# EAGLE design samd21_QFP_reference (EAGLE 9.2.2)
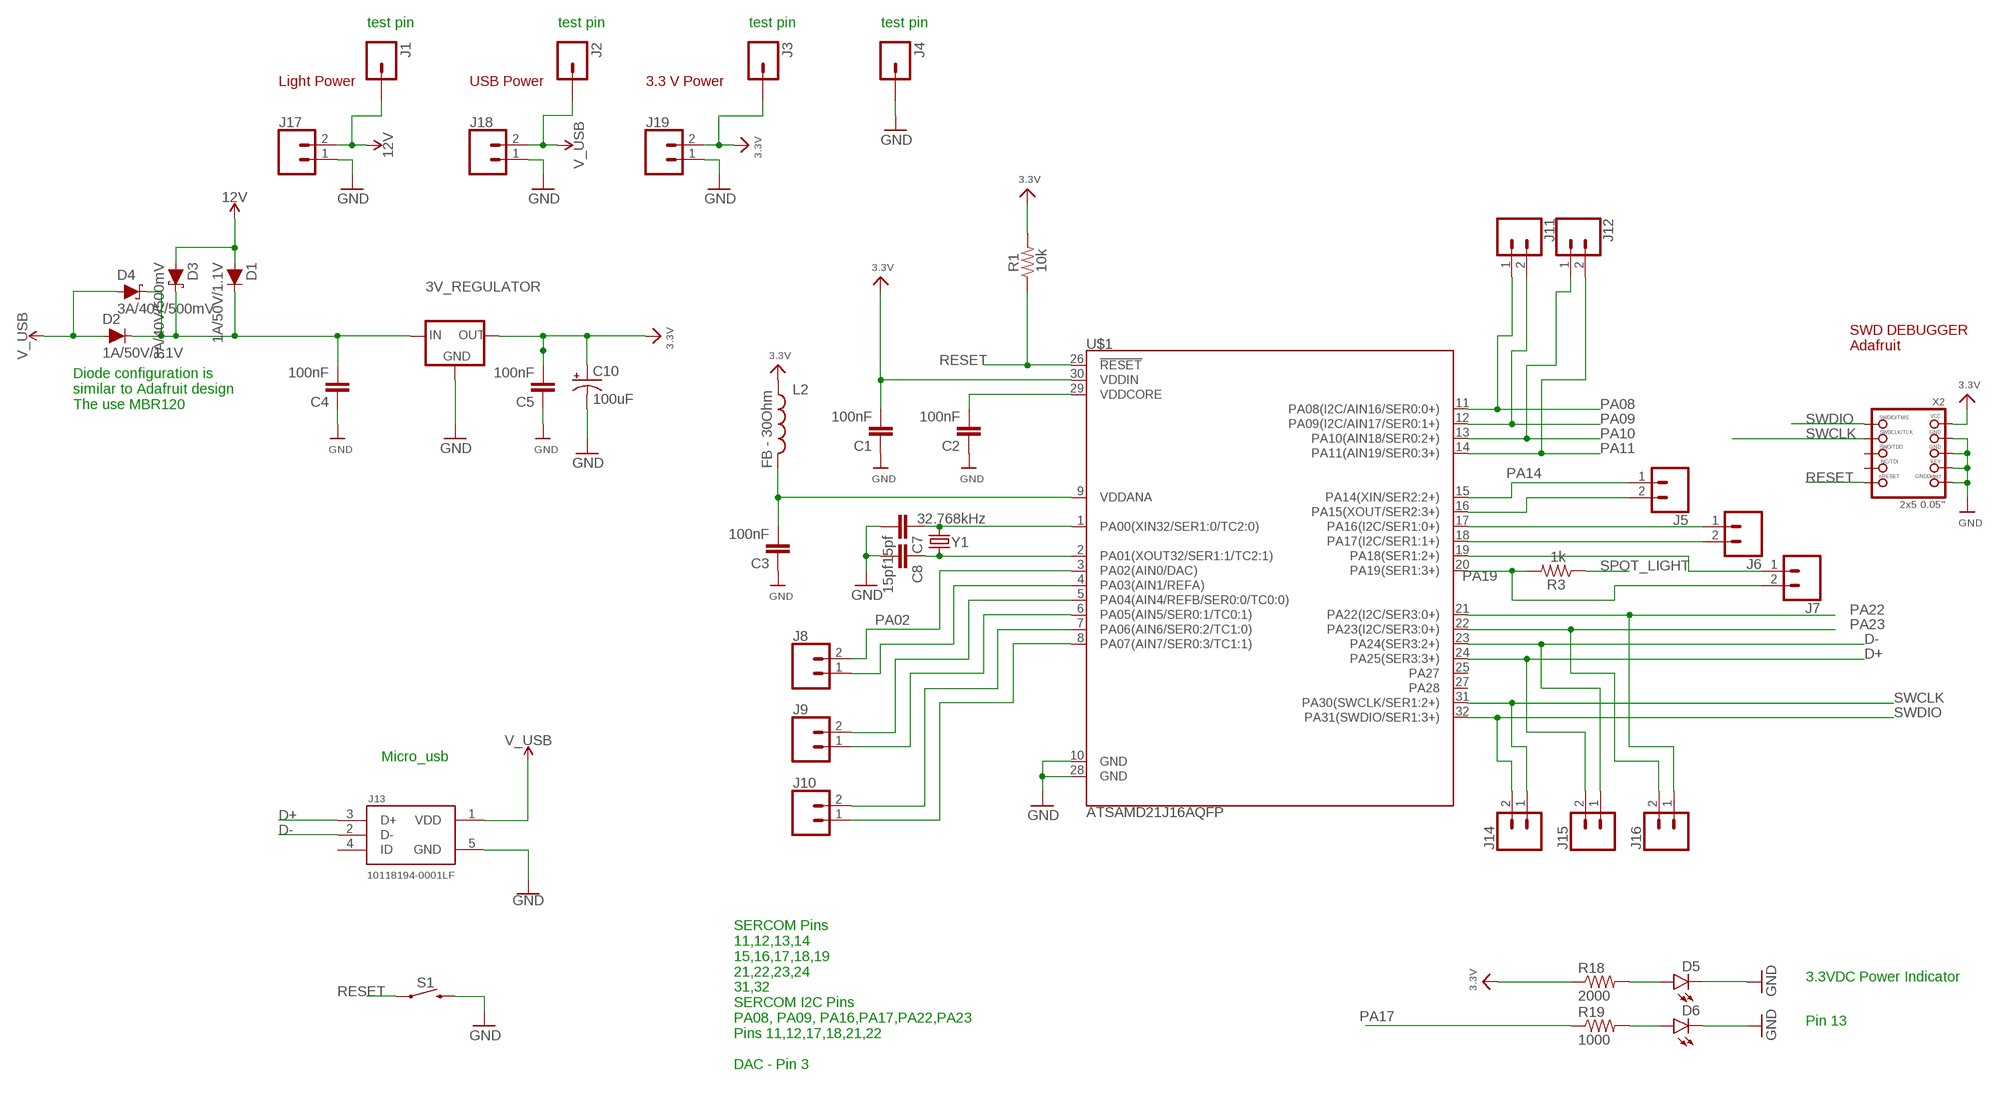
[diagram p0: schematic, sheet 1, part 1 of 2]
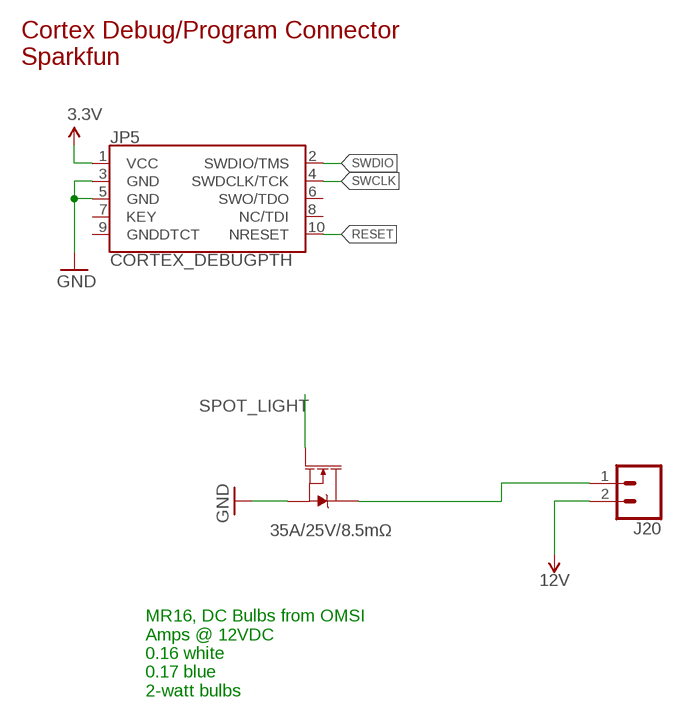
[diagram p1: schematic, sheet 1, part 2 of 2]

## Parts
3V_REGULATOR  LDL1117_5V_REG  [SOT223]
C1  100nF  10UF-0805-10V-10%  [0805]
C2  100nF  10UF-0805-10V-10%  [0805]
C3  100nF  10UF-0805-10V-10%  [0805]
C4  100nF  10UF-0805-10V-10%  [0805]
C5  100nF  10UF-0805-10V-10%  [0805]
C7  15pf  10UF-0805-10V-10%  [0805]
C8  15pf  10UF-0805-10V-10%  [0805]
C10  100uF  100UF-POLAR-RADIAL-2.5MM-25V-20%  [CPOL-RADIAL-2.5MM-6.5MM]
D1  1A/50V/1.1V  DIODE-PTH  [DIODE-1N4001]
D2  1A/50V/1.1V  DIODE-PTH  [DIODE-1N4001]
D3  3A/40V/500mV  DIODE-SCHOTTKY-B340A  [SMA-DIODE]
D4  3A/40V/500mV  DIODE-SCHOTTKY-B340A  [SMA-DIODE]
D5  LED1206  [LED-1206]
D6  LED1206  [LED-1206]
J1  M01PTH  [1X01]
J2  M01PTH  [1X01]
J3  M01PTH  [1X01]
J4  M01PTH  [1X01]
J5  CONN_025MM  [SCREWTERMINAL-5MM-2]
J6  CONN_025MM  [SCREWTERMINAL-5MM-2]
J7  CONN_025MM  [SCREWTERMINAL-5MM-2]
J8  CONN_025MM  [SCREWTERMINAL-5MM-2]
J9  CONN_025MM  [SCREWTERMINAL-5MM-2]
J10  CONN_025MM  [SCREWTERMINAL-5MM-2]
J11  CONN_025MM  [SCREWTERMINAL-5MM-2]
J12  CONN_025MM  [SCREWTERMINAL-5MM-2]
J13  10118194-0001LF  [FRAMATOME_10118194-0001LF]
J14  CONN_025MM  [SCREWTERMINAL-5MM-2]
J15  CONN_025MM  [SCREWTERMINAL-5MM-2]
J16  CONN_025MM  [SCREWTERMINAL-5MM-2]
J17  CONN_025MM  [SCREWTERMINAL-5MM-2]
J18  CONN_025MM  [SCREWTERMINAL-5MM-2]
J19  CONN_025MM  [SCREWTERMINAL-5MM-2]
J20  CONN_025MM  [SCREWTERMINAL-5MM-2]
JP5  CORTEX_DEBUGPTH  [2X5-PTH-1.27MM]
L2  FB - 30Ohm  INDUCTOR0805  [0805@1]
Q1  35A/25V/8.5mΩ  MOSFET-NCH-FDD8780  [DPAK]
R1  10k  RESISTOR0805  [0805]
R3  1k  RESISTOR0805  [0805]
R18  2000  RESISTOR0805-RES  [0805]
R19  1000  RESISTOR0805-RES  [0805]
S1  MOMENTARY-SWITCH-SPST-PTH-6.0MM-KIT  [TACTILE_SWITCH_PTH_6.0MM_KIT]
U$1  ATSAMD21J16AQFP  [TQFP32-08]
X2  2x5 0.05"  JTAG-CORTEXBOXPOSTS  [2X05_1.27MM_BOX_POSTS]
Y1  32.768kHz  CRYSTAL3.2X1.5MM  [CRYSTAL-SMD-3.2X1.5MM]

## Nets
3.3V [power]: 3V_REGULATOR.2(OUT) 3V_REGULATOR.4(OUT) C1.2 C5.2 C10.1(+) J3.1 J19.2 JP5.1(VCC) L2.1 R1.2 R18.1 U$1.30(VDDIN) X2.1(VCC)
12V: D1.A D3.A J1.1 J17.2 J20.2
D+: J13.3(D+) J15.2 U$1.24(PA25(SER3:3+))
D-: J13.2(D-) J15.1 U$1.23(PA24(SER3:2+))
GND: 3V_REGULATOR.1(GND) C1.1 C2.1 C3.1 C4.1 C5.1 C7.2 C8.2 C10.2(-) D5.C D6.C J4.1 J13.5(GND) J17.1 J18.1 J19.1 JP5.3(GND) JP5.5(GND) Q1.3(S) S1.3 U$1.10(GND) U$1.28(GND) X2.3(GND) X2.5(GND) X2.7(KEY) X2.9(GNDDETECT)
N$1: C3.2 L2.2 U$1.9(VDDANA)
N$2: C7.1 U$1.1(PA00(XIN32/SER1:0/TC2:0)) Y1.P$2
N$3: C2.2 U$1.29(VDDCORE)
N$4: C8.1 U$1.2(PA01(XOUT32/SER1:1/TC2:1)) Y1.P$1
N$5: 3V_REGULATOR.3(IN) C4.2 D1.C D2.C D3.C D4.C
N$21: J20.1 Q1.4(D)
N$30: D5.A R18.2
N$31: D6.A R19.2
PA02: J8.2 U$1.3(PA02(AIN0/DAC))
PA03: J8.1 U$1.4(PA03(AIN1/REFA))
PA04: J9.2 U$1.5(PA04(AIN4/REFB/SER0:0/TC0:0))
PA05: J9.1 U$1.6(PA05(AIN5/SER0:1/TC0:1))
PA06: J10.2 U$1.7(PA06(AIN6/SER0:2/TC1:0))
PA07: J10.1 U$1.8(PA07(AIN7/SER0:3/TC1:1))
PA08: J11.1 U$1.11(PA08(I2C/AIN16/SER0:0+))
PA09: J11.2 U$1.12(PA09(I2C/AIN17/SER0:1+))
PA10: J12.1 U$1.13(PA10(AIN18/SER0:2+))
PA11: J12.2 U$1.14(PA11(AIN19/SER0:3+))
PA14: J5.1 U$1.15(PA14(XIN/SER2:2+))
PA15: J5.2 U$1.16(PA15(XOUT/SER2:3+))
PA16: J6.1 U$1.17(PA16(I2C/SER1:0+))
PA17: J6.2 R19.1 U$1.18(PA17(I2C/SER1:1+))
PA18: J7.1 U$1.19(PA18(SER1:2+))
PA19: J7.2 R3.2 U$1.20(PA19(SER1:3+))
PA22: J16.1 U$1.21(PA22(I2C/SER3:0+))
PA23: J16.2 U$1.22(PA23(I2C/SER3:0+))
RESET: JP5.10(NRESET) R1.1 S1.1 U$1.26(!RESET!) X2.10(NRESET)
SPOT_LIGHT: Q1.1(G) R3.1
SWCLK: J14.1 JP5.4(SWDCLK/TCK) U$1.31(PA30(SWCLK/SER1:2+)) X2.4(SWDCLK)
SWDIO: J14.2 JP5.2(SWDIO/TMS) U$1.32(PA31(SWDIO/SER1:3+)) X2.2(SWDIO)
V_USB: D2.A D4.A J2.1 J13.1(VDD) J18.2
Unconnected: J13.4(ID) JP5.6(SWO/TDO) JP5.7(KEY) JP5.8(NC/TDI) JP5.9(GNDDTCT) U$1.25(PA27) U$1.27(PA28) X2.6(SWO) X2.8(TDI)

## Notes on the sheet
- test pin | test pin | test pin | test pin
- Light Power | USB Power | 3.3 V Power
- Cortex Debug/Program Connector
  Sparkfun
- SWD DEBUGGER
  Adafruit
- Diode configuration is
  similar to Adafruit design
  The use MBR120
- Micro_usb
- MR16, DC Bulbs from OMSI
  Amps @ 12VDC
  0.16 white
  0.17 blue
  2-watt bulbs
- 3.3VDC Power Indicator
- Pin 13
- SERCOM Pins
  11,12,13,14
  15,16,17,18,19
  21,22,23,24
  31,32
  SERCOM I2C Pins
  PA08, PA09, PA16,PA17,PA22,PA23
  Pins 11,12,17,18,21,22
  
  DAC - Pin 3

## Library data of the parts
3V_REGULATOR = th_libraries_2:LDL1117_5V_REG: STMicroelectronics LDL1117S50R https://www.mouser.com/datasheet/2/389/ldl1117-1156241.pdf Mouser#: 511-LDL1117S50R bought 100 for $18 on ~2/3/18 5V, 1.2amp
C1-C5 C7 C8 = SparkFun-Capacitors:10UF: 10.0µF ceramic capacitors A capacitor is a passive two-terminal electrical component used to store electrical energy temporarily in an electric field.; PROD_ID: CAP-11330; VALUE: 10uF
C10 = SparkFun-Capacitors:100UF-POLAR: 100µF polarized capacitors A capacitor is a passive two-terminal electrical component used to store electrical energy temporarily in an electric field.; PROD_ID: CAP-08439
D1 D2 = SparkFun-DiscreteSemi:DIODE: Diode These are standard reverse protection diodes and small signal diodes. SparkFun Products: SparkFun SparkPunk Sound Kit <https://www.sparkfun.com/products/11177> SparkFun ESP8266 Thing <https://www.sparkfun.com/products/13231>; PROD_ID: DIO-09176
D3 D4 = SparkFun-DiscreteSemi:DIODE-SCHOTTKY: Schottky diode A Schottky diode is a semiconductor diode which has a low forward voltage drop and a very fast switching action.; PROD_ID: DIO-09886
D5 D6 = SparkFun-LED:LED: LEDs Standard schematic elements and footprints for 5mm, 3mm, 1206, and 0603 sized LEDs. 5mm - Spark Fun Electronics SKU : COM-00529 (and others)
J1-J4 = SparkFun-Connectors:M01: Header 1 Standard 1-pin 0.1" header. Use with straight break away headers (SKU : PRT-00116), right angle break away headers (PRT-00553), swiss pins (PRT-00743), machine pins (PRT-00117), and female headers (PRT-00115). SMTSO-256-ET is a "flush mount" nut for a 4-40 screw. The older package used to be too tight, and did not allow it to sit properly thru the drill hit. The latest (0.165DIA) fits nice and snug.
J5-J12 J14-J20 = SparkFun-Connectors:CONN_02: Multi connection point. Often used as Generic Header-pin footprint for 0.1 inch spaced/style header connections On any of the 0.1 inch spaced packages, you can populate with these: Break Away Headers - Straight <https://www.sparkfun.com/products/116> (PRT-00116) Break Away Male Headers - Right Angle <https://www.sparkfun.com/products/553> (PRT-00553) Female Headers <https://www.sparkfun.com/products/115> (PRT-00115) Break Away Headers - Machine Pin <https://www.sparkfun.com/products/117> (PRT-00117) Break Away Female Headers - Swiss Machine Pin <https://www.sparkfun.com/products/743> (PRT-00743) For SCREWTERMINALS and SPRING TERMINALS visit here: Screw Terimnals on SparkFun.com <https://www.sparkfun.com/search/results?term=Screw+Terminals> (5mm/3.5mm/2.54mm spacing) This device is also useful as a general connection point to wire up your design to another part of your project. Our various solder wires solder well into these plated through hole pads. Hook-Up Wire - Assortment (Stranded, 22 AWG) <https://www.sparkfun.com/products/11375> (PRT-11375) Hook-Up Wire - Assortment (Solid Core, 22 AWG) <https://www.sparkfun.com/products/11367> (PRT-11367) View the entire wire category on our website here <https://www.sparkfun.com/categories/141> Special notes: Molex polarized connector foot print use with: PRT-08233 with associated crimp pins and housings. 2.54_SCREWTERM for use with PRT-10571. 3.5mm Screw Terminal footprints for PRT-08084 5mm Screw Terminal footprints for use with PRT-08432; SF_SKU: PRT-08432
J13 = 10118194-0001LF:10118194-0001LF: Conn Micro USB Type B RCP 5 POS 0.65mm Solder RA SMD 5 Terminal 1 Port T/R; AVAILABILITY: Unavailable; DESCRIPTION: Micro Usb, 2.0 Type b, Rcpt, Smt; MF: Amphenol ICC; MP: 10118194-0001LF; PACKAGE: None; PRICE: None
JP5 = samd21-temp:CORTEX_DEBUG: Cortex Debug Connector Datasheet <http://infocenter.arm.com/help/topic/com.arm.doc.faqs/attached/13634/cortex_debug_connectors.pdf>
L2 = SparkFun-Passives:INDUCTOR: Inductors Basic Inductor/Choke - 0603 and 1206. Footprints are not proven and vary greatly between part numbers. INDUCTOR POWER 3.3UH 4.0A SMD 0.197" L x 0.197" W x 0.177" H (5.00mm x 5.00mm x 4.50mm); PROD_ID: RES-07859
Q1 = th_libraries_2:MOSFET-NCH: N-channel MOSFETs Voltage controlled devices that allow control of high current outputs. SparkFun Products: SparkFun OpenScale <https://www.sparkfun.com/products/13261> SparkFun Digital Sandbox <https://www.sparkfun.com/products/12651> SparkFun Monster Moto Shield <https://www.sparkfun.com/products/10182> SparkFun MOSFET Power Controller <https://www.sparkfun.com/products/11214>; PROD_ID: TRANS-09984
R1 R3 = SparkFun-Resistors:RESISTOR: Generic Resistor Package
R18 R19 = SparkFun-Passives:RESISTOR: Resistor Basic schematic elements and footprints for 0603, 1206, and PTH resistors.
S1 = SparkFun-Switches:MOMENTARY-SWITCH-SPST: Momentary Switch (Pushbutton) - SPST Normally-open (NO) SPST momentary switches (buttons, pushbuttons). Variants PTH-12MM - 12mm square, through-hole Momentary Pushbutton Switch - 12mm Square <https://www.sparkfun.com/products/9190> (COM-09190) PTH-6.0MM, PTH-6.0MM-KIT - 6.0mm square, through-hole Mini Pushbutton Switch <https://www.sparkfun.com/products/97> (COM-00097) KIT package intended for soldering kit's - only one side of pads' copper is exposed. PTH-RIGHT-ANGLE-KIT - Right-angle, through-hole Right Angle Tactile Button <https://www.sparkfun.com/products/10791> - Used on SparkFun BigTime Watch Kit <https://www.sparkfun.com/products/11734> SMD-12MM - 12mm square, surface-mount Tactile Button - SMD (12mm) <https://www.sparkfun.com/products/12993> (COM-12993) Used on SparkFun PicoBoard <https://www.sparkfun.com/products/11888> SMD-4.5MM - 4.5mm Square Trackball Switch Used on SparkFun Blackberry Trackballer Breakout <https://www.sparkfun.com/products/13169> SMD-4.6MMX2.8MM - 4.60mm x 2.80mm, surface mount Used on SparkFun SAMD21 Mini Breakout <https://www.sparkfun.com/products/13664> SMD-5.2MM, SMD-5.2-REDUNDANT - 5.2mm square, surface-mount Mini Pushbutton Switch - SMD <https://www.sparkfun.com/products/8720> (COM-08720) Used on Arduino Pro Mini <https://www.sparkfun.com/products/11114> REDUNDANT package connects both switch circuits together SMD-6.0X3.5MM - 6.0 x 3.5mm, surface mount Momentary Reset Switch SMD <https://www.sparkfun.com/products/8229> (COM-08229) SMD-6.2MM-TALL - 6.2mm square, surface mount Tactile Button - SMD (6mm) <https://www.sparkfun.com/products/12992> Used on SparkFun Digital Sandbox <https://www.sparkfun.com/products/12651> SMD-RIGHT-ANGLE - Right-angle, surface mount Used on SparkFun Block for Intel® Edison - Arduino <https://www.sparkfun.com/products/13036>; PROD_ID: SWCH-08441; SF_SKU: COM-00097
U$1 = th_libraries_2:ATSAMD21J16A: ATSAMD21E - 32 pin packages ATSAMD21E15 is 32kb flash ATSAMD21E16 is 64kb flash ATSAMD21E17 is 128kb flash ATSAMD21E18 is 256kb flash
X2 = microbuilder:JTAG-CORTEX: Serial Wire (SW-DP) Connector Standard 0.05" 10-pin connector is for use with the Cortex M and Cortex A SWD (serial wire debugger) interface (SW-DP) Connectors 2x05_1.27MM_SMT - Inexpensive surface-mount header with bare pins, compatible with standard 10-pin SWD cables (4UCON: 16846) 2x05_1.27MM_BOX_NOPOSTS - Polarised surface-mount box (4UCON with caps: 19735, without caps: 15117 2x05_1.27MM_BOX_POSTS - Polarised surface-mount box with mounting holes (4UCON: 20317) Pinout: http://infocenter.arm.com/help/topic/com.arm.doc.faqs/attached/13634/cortex_debug_connectors.pdf http://www.keil.com/peripherals/coresight/connectors.asp
Y1 = samd21-temp:CRYSTAL: Various standard crystals. Proven footprints.; PROD_ID: XTAL-13062

## Net classes
1 power: width 0.254 mm

## Board
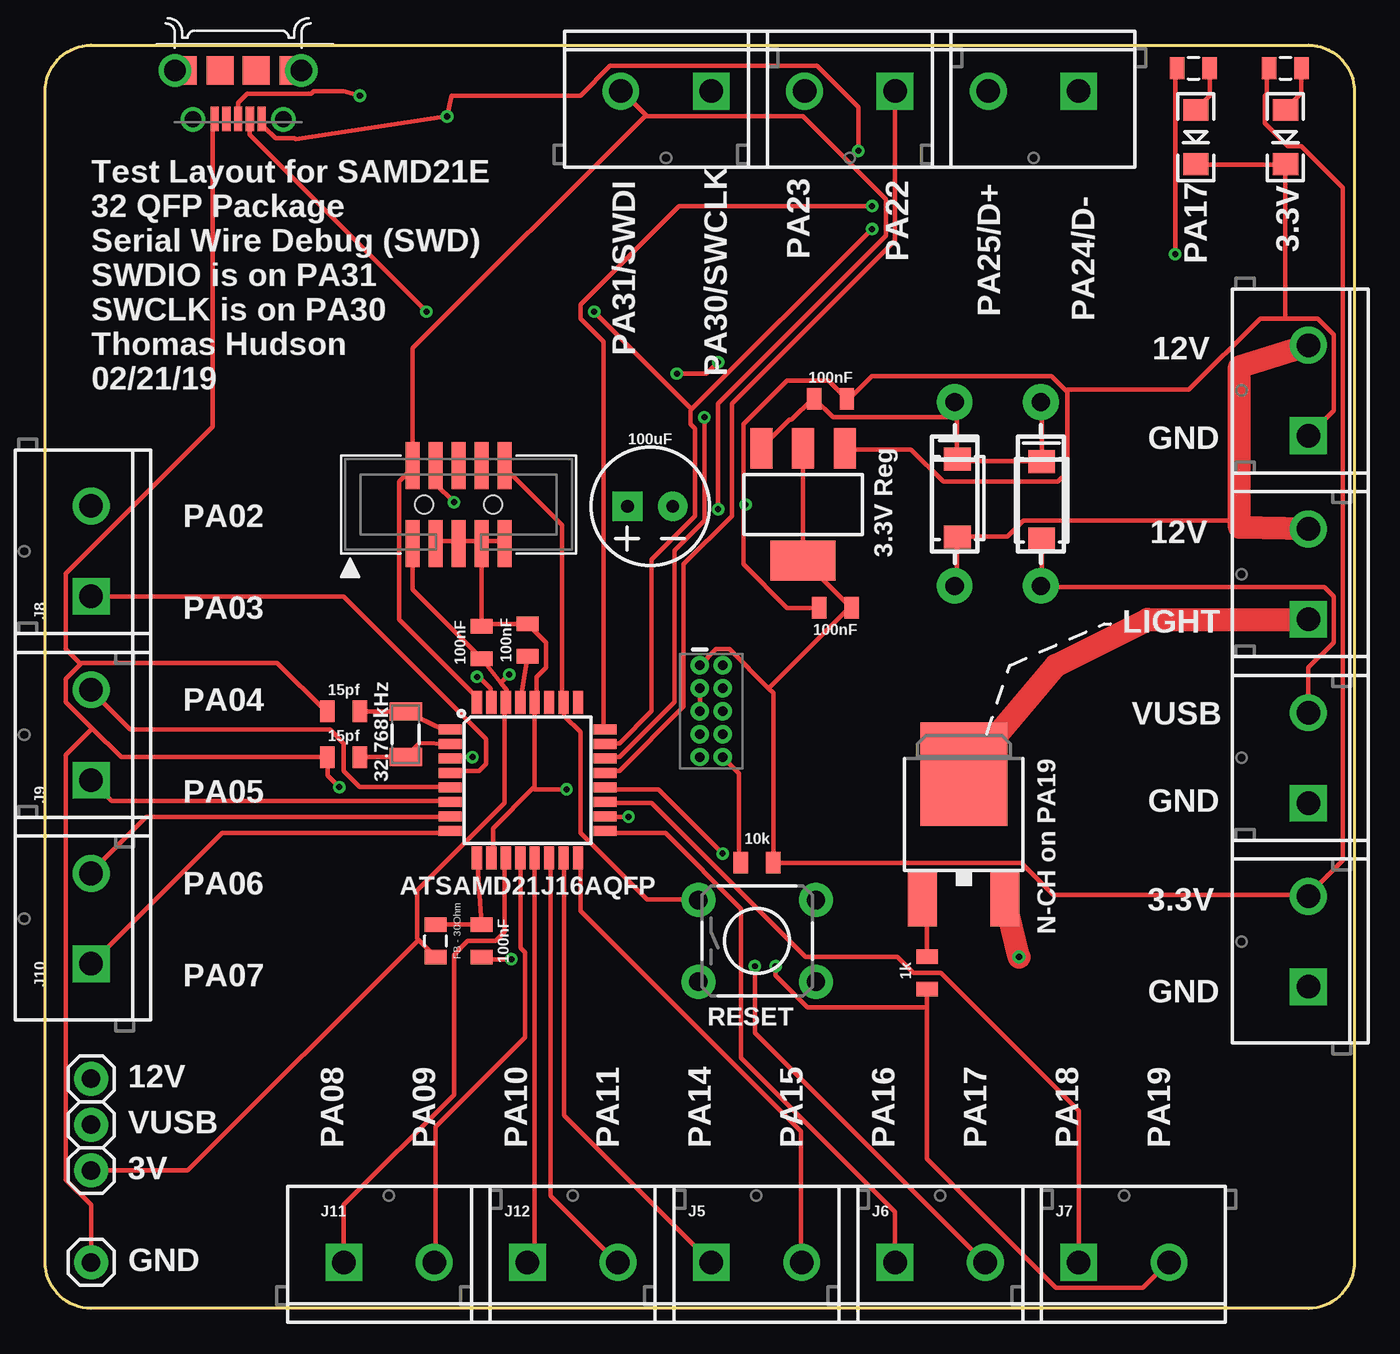
[diagram p2: board, top side]
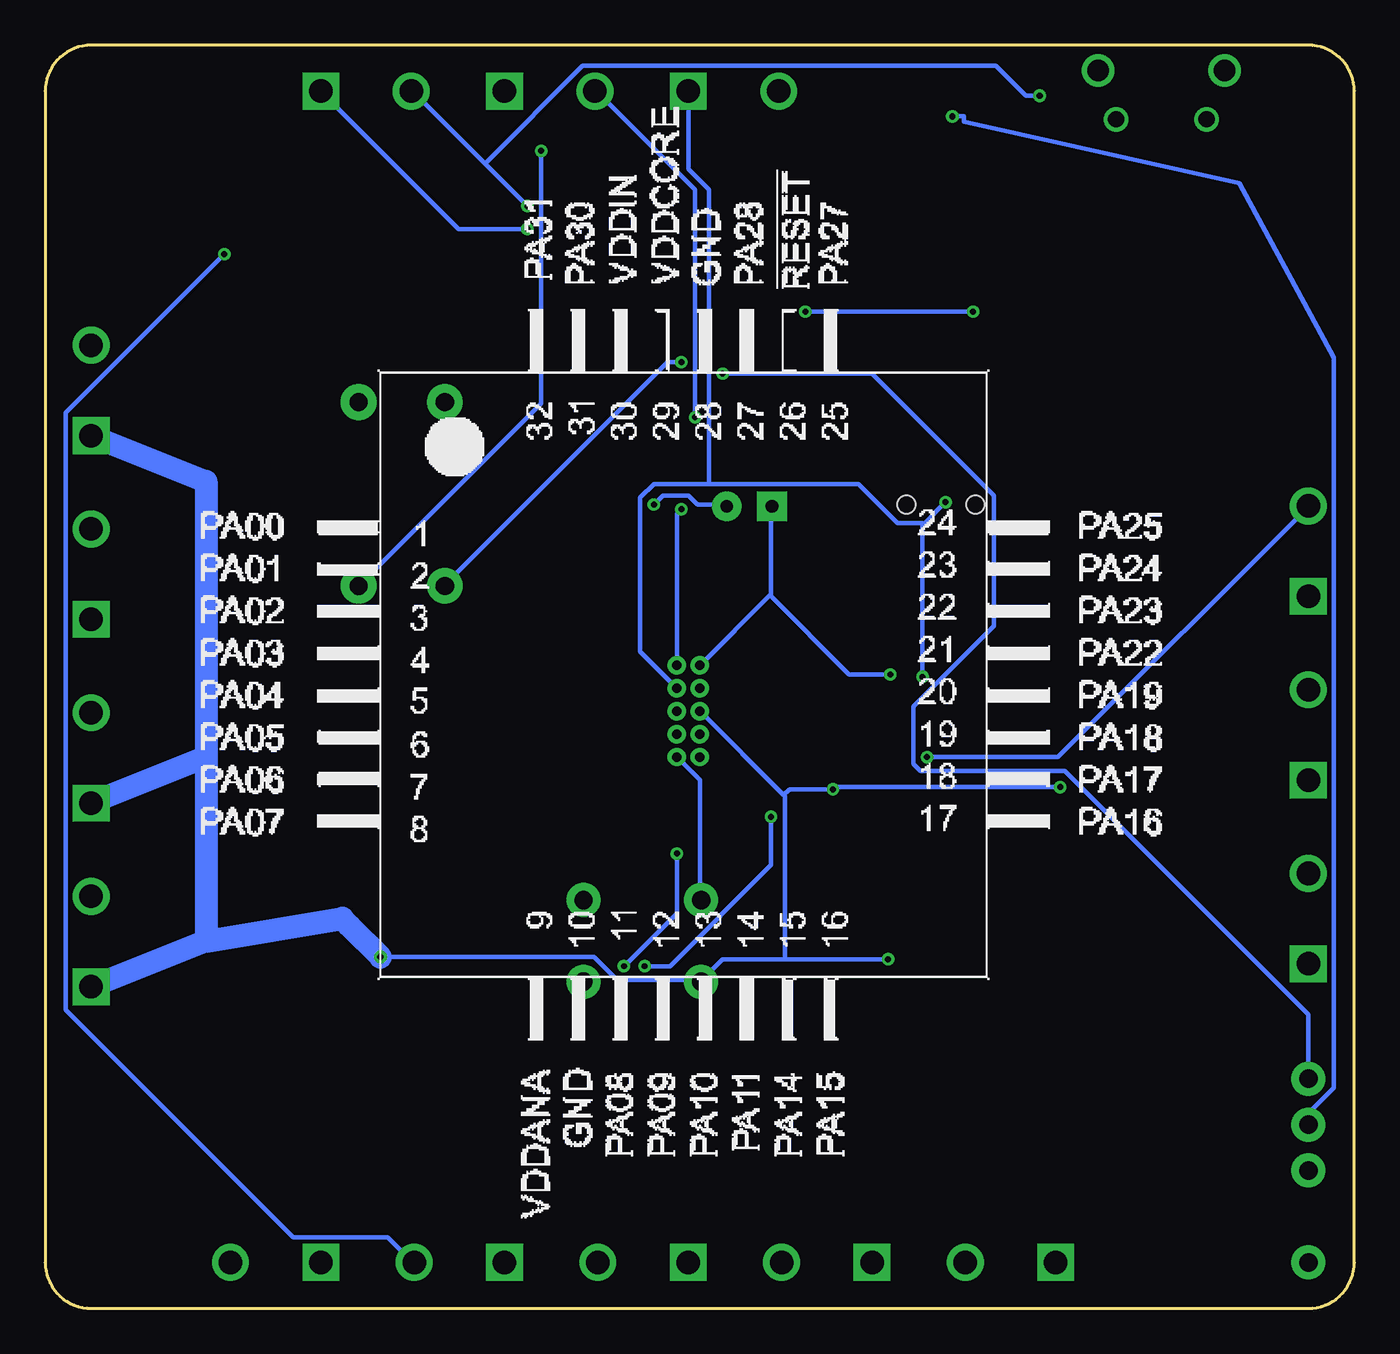
[diagram p3: board, bottom side, seen from below]

Size 72.39 x 69.85 mm. Coordinates in mm from the lower left corner, seen from the top.
Outline: 69.85,0 2.54,0 arc-90 0,2.54 0,67.31 arc-90 2.54,69.85 69.85,69.85 arc-90 72.39,67.31 72.39,2.54 arc-90 69.85,0
Copper layers (1*16): Top 0.0356mm / dielectric 1.5011mm / Bottom 0.0356mm
Design rules "LaenPCBOrder *": minimum track width 10mil, minimum drill 13mil, track to track 10mil, track to pad 10mil, pad to pad 10mil, via to via 10mil, smd to smd 10mil, copper to edge 15mil, drill to drill 8mil, minimum pad ring 7mil, minimum via ring 7mil, stop-mask expansion 3mil, vias tented up to drill 25mil, thermal gap 10mil

### Footprints (pad centres in the part's own frame; a part is rotated, then mirrored left to right if it is on the bottom)
SOT223 = smd 1.219 x 2.235: 1 -2.311,-3.099; 2 0,-3.099; 3 2.311,-3.099 | smd 3.6 x 2.2: 4 0,3.099
0805 = smd 0.8 x 1.2: 1 -0.9,0; 2 0.9,0
CPOL-RADIAL-2.5MM-6.5MM = drill 0.7 pad 1.651 square: 1 1.25,0 | drill 0.7 pad 1.651: 2 -1.25,0
DIODE-1N4001 = drill 1 pad 1.981: A -5.08,0; C 5.08,0
SMA-DIODE = smd 1.27 x 1.47: A -2.15,0; C 2.15,0
LED-1206 = smd 1.2 x 1.4: A -1.5,0; C 1.5,0
1X01 = drill 1.016 pad 1.88: 1 0,0
SCREWTERMINAL-5MM-2 = drill 1.3 pad 2.032 square: 1 0,0 | drill 1.3 pad 2.032: 2 5,0
FRAMATOME_10118194-0001LF = smd 0.45 x 1.35: 1 -1.3,2.675; 2 -0.65,2.675; 3 0,2.675; 4 0.65,2.675; 5 1.3,2.675 | drill 0.9: P$6 -2.5,2.7; P$7 2.5,2.7 | drill 1.2: P$8 -3.5,0; P$9 3.5,0 | smd 1.5 x 1.55: P$10 -1,0; P$11 1,0; P$12 -3.05,0; P$13 3.05,0
2X5-PTH-1.27MM = drill 0.508 pad 1: 1 -2.54,-0.635; 2 -2.54,0.635; 3 -1.27,-0.635; 4 -1.27,0.635; 5 0,-0.635; 6 0,0.635; 7 1.27,-0.635; 8 1.27,0.635; 9 2.54,-0.635; 10 2.54,0.635
0805@1 = smd 0.8 x 1.2: 1 -0.9,0; 2 0.9,0
DPAK = smd 1.6 x 3: 1 -2.28,-5.31; 3 2.28,-5.31 | smd 4.826 x 5.715: 4 0,1.588
TACTILE_SWITCH_PTH_6.0MM_KIT = drill 1.016 pad 1.88: 1 -3.251,2.261; 2 3.251,2.261; 3 -3.251,-2.261; 4 3.251,-2.261
TQFP32-08 = smd 1.27 x 0.559: 1 -4.293,2.8; 2 -4.293,2; 3 -4.293,1.2; 4 -4.293,0.4; 5 -4.293,-0.4; 6 -4.293,-1.2; 7 -4.293,-2; 8 -4.293,-2.8; 17 4.293,-2.8; 18 4.293,-2; 19 4.293,-1.2; 20 4.293,-0.4; 21 4.293,0.4; 22 4.293,1.2; 23 4.293,2; 24 4.293,2.8 | smd 0.559 x 1.27: 9 -2.8,-4.293; 10 -2,-4.293; 11 -1.2,-4.293; 12 -0.4,-4.293; 13 0.4,-4.293; 14 1.2,-4.293; 15 2,-4.293; 16 2.8,-4.293; 25 2.8,4.293; 26 2,4.293; 27 1.2,4.293; 28 0.4,4.293; 29 -0.4,4.293; 30 -1.2,4.293; 31 -2,4.293; 32 -2.8,4.293
2X05_1.27MM_BOX_POSTS = smd 0.76 x 2.6: 1 -2.54,-2.15; 2 -2.54,2.15; 3 -1.27,-2.15; 4 -1.27,2.15; 5 0,-2.15; 6 0,2.15; 7 1.27,-2.15; 8 1.27,2.15; 9 2.54,-2.15; 10 2.54,2.15 | hole 1: -1.905,0; 1.905,0
CRYSTAL-SMD-3.2X1.5MM = smd 1 x 1.8: P$1 -1.25,0; P$2 1.25,0

### Placement (x,y rotation side)
3V_REGULATOR  41.91,44.45 180 top
C1  24.13,36.83 270 top
C2  26.67,36.96 270 top
C3  24.13,20.32 90 top
C4  43.43,50.29 180 top
C5  43.69,38.73 0 top
C7  16.51,33.02 180 top
C8  16.51,30.48 180 top
C10  33.45,44.35 180 top
D1  50.29,45.03 90 top
D2  55.07,45.03 90 top
D3  50.44,44.81 90 top
D4  55.09,44.68 90 top
D5  68.58,64.77 270 top
D6  63.63,64.77 270 top
J1  2.54,12.7 0 top
J2  2.54,10.16 0 top
J3  2.54,7.62 0 top
J4  2.54,2.54 0 top
J5  36.83,2.54 0 top
J6  46.99,2.54 0 top
J7  57.15,2.54 0 top
J8  2.54,39.37 90 top
J9  2.54,29.21 90 top
J10  2.54,19.05 90 top
J11  16.51,2.54 0 top
J12  26.67,2.54 0 top
J13  10.67,68.45 180 top
J14  36.83,67.31 180 top
J15  57.15,67.31 180 top
J16  46.99,67.31 180 top
J17  69.85,48.26 90 top
J18  69.85,27.94 90 top
J19  69.85,17.78 90 top
J20  69.85,38.1 90 top
JP5  36.83,33.02 270 top
L2  21.59,20.32 90 top
Q1  50.8,27.94 0 top
R1  39.37,24.64 0 top
R3  48.77,18.54 270 top
R18  68.58,68.58 0 top
R19  63.5,68.58 0 top
S1  39.37,20.32 0 top
U$1  26.67,29.21 0 top
X2  22.86,44.45 0 top
Y1  19.94,31.75 90 top

### Tracks (layer width: path | path; a pad name or v marks a point on that pad's centre or on a via)
3.3V  (via drill 0.33)
  Top 0.254: 25.18,34.6 C1.2 20.32,39.75 X2.1 | 25.18,34.6 25.53,34.16 U$1.30 25.4,33.4 25.4,27.94 20.57,23.11 20.57,20.45 20.64,20.38 | 20.64,20.38 21.59,19.43 L2.1 | 41.91,41.4 44.58,38.73 C5.2 44.45,38.73 40,34.29 | 41.91,41.4 3V_REGULATOR.2 | 41.91,41.4 3V_REGULATOR.4 | 40,34.29 37.85,36.45 37.08,36.45 JP5.1 | 40,34.29 40.26,34.04 40.26,24.64 R1.2 53.97,24.64 55.75,22.86 69.85,22.86 | v25.65,35.05 25.27,34.67 25.18,34.6 | 69.85,22.86 71.75,24.76 71.75,61.98 69.47,64.26 68.71,64.26 67.44,65.53 67.44,67.06 67.56,67.18 67.56,68.58 R18.1 | 69.85,22.86 J19.2 | J3.1 7.87,7.62 20.64,20.38
  Bottom 0.254: JP5.1 32.32,39.43 | 32.32,39.43 32.26,39.5 32.26,44.32 C10.1 | v25.65,35.05 27.94,35.05 32.32,39.43
12V  (via drill 0.33)
  Top 0.254: D1.A 50.29,40.01 50.42,40.13 50.42,42.55 D3.A 50.55,42.67 53.21,42.67 54.1,43.56 66.04,43.56 | v34.92,51.69 36.58,51.69 v37.21,52.32
  Top 1.27: J20.2 66.04,43.18 66.04,43.56 66.04,52.07 J17.2
  Bottom 0.254: J1.1 2.54,16.26 16,29.72 24,29.72 24.38,30.1 24.38,33.27 19.94,37.72 19.94,44.96 26.67,51.69 v34.92,51.69 | v37.21,52.32 37.97,52.32 50.29,40.01 D1.A
D+  (via drill 0.33, 0.35)
  Top 0.254: v45.72,60.96 35.05,60.96 29.59,55.5 29.59,54.74 30.86,53.47 30.86,32.13 U$1.24 | J13.3 10.67,66.67 11.16,67.17 14.7,67.17 14.84,67.31 16.51,67.31 v17.4,67.06
  Bottom 0.254: 48.07,63.31 52.07,67.31 J15.2 | 48.07,63.31 v45.72,60.96 | v17.4,67.06 18.16,67.06 19.81,68.71 42.67,68.71 48.07,63.31
D-  (via drill 0.33)
  Top 0.254: v45.72,59.69 35.75,49.72 | 35.75,49.72 35.69,49.66 35.69,48.9 35.94,48.64 35.94,43.82 33.53,41.4 33.53,33.02 31.75,31.24 30.99,31.24 U$1.23 | v21.08,55.12 11.3,64.9 11.3,65.66 J13.2 | 35.75,49.72 v30.35,55.12
  Bottom 0.254: v45.72,59.69 49.53,59.69 J15.1 | v30.35,55.12 v21.08,55.12
GND  (via drill 0.33, 0.35)
  Top 0.254: 2.6,32.07 1.14,33.53 1.14,34.8 1.97,35.62 | 2.6,32.07 4.19,30.48 C8.2 15.62,30.48 15.62,29.46 v16.26,28.83 | 1.97,35.62 2.03,35.69 12.83,35.69 15.49,33.02 C7.2 | 1.97,35.62 1.14,36.45 1.14,40.64 9.27,48.77 9.27,65.66 J13.5 | 26.99,28.77 27.05,28.83 27.05,33.4 U$1.28 27.18,33.53 27.18,34.92 27.69,35.43 27.69,36.83 26.67,37.85 | 26.99,28.77 24.76,26.54 24.76,25.02 U$1.10 | 22.86,42.42 21.59,42.42 X2.3 | 26.67,37.85 24.13,37.85 | 24.13,37.85 X2.7 24.13,42.42 | 24.13,37.85 C1.1 | 24.13,42.42 25.4,42.42 X2.9 | 24.13,42.42 22.86,42.42 | 22.86,42.42 X2.5 | 26.67,37.85 C2.1 | JP5.3 JP5.5 | v25.78,19.3 24.13,19.3 C3.1 | v28.83,28.7 27.05,28.7 26.99,28.77 | C5.1 41.02,38.73 38.61,41.15 38.61,44.45 | 38.61,44.45 38.61,48.9 41.02,51.31 43.31,51.31 C4.1 44.45,50.29 45.72,51.56 55.63,51.56 56.45,50.74 | 56.45,50.74 56.51,50.67 56.51,46.23 56.01,45.72 49.66,45.72 47.88,47.5 44.32,47.5 3V_REGULATOR.1 | 38.61,44.45 v38.73,44.45 | 68.58,54.74 70.36,54.74 71.25,53.85 71.25,49.66 J17.1 | 68.58,54.74 67.18,54.74 63.25,50.8 56.51,50.8 56.45,50.74 | 68.58,63.25 63.63,63.25 D6.C | 68.58,54.74 68.58,63.25 | 68.58,63.25 D5.C | J4.1 2.54,5.71 1.14,7.11 1.14,30.61 2.6,32.07
  Top 1.27: v53.85,19.43 Q1.3
  Bottom 0.254: 31.5,19.3 34.92,19.3 36.07,18.16 S1.3 36.19,18.16 40.77,18.16 42.04,19.43 v53.85,19.43 | 31.5,19.3 v25.78,19.3 | 31.56,28.38 31.5,28.32 31.5,19.3 | 31.56,28.38 JP5.5 | 31.56,28.38 31.24,28.7 v28.83,28.7 28.7,28.83 v16.26,28.83 | v38.73,44.45 38.23,44.96 36.83,44.96 36.32,44.45 34.8,44.45 C10.2
  Bottom 1.27: J17.1 63.5,45.72 63.5,30.48 | 63.5,30.48 J18.1 | 63.5,30.48 63.5,20.32 63.55,20.3 | 63.55,20.3 J19.1 | 63.55,20.3 55.96,21.56 55.55,21.13 v53.85,19.43
N$1
  Top 0.254: U$1.9 C3.2 L2.2
N$2
  Top 0.254: U$1.1 22,32.01 Y1.P$2 C7.1
N$3
  Top 0.254: U$1.29 C2.2
N$4
  Top 0.254: U$1.2 20.71,31.25 Y1.P$1 C8.1
N$5
  Top 0.254: D2.C 55.12,50.04 55.12,46.86 D4.C 54.99,46.86 50.55,46.86 D3.C 50.42,46.99 50.42,49.28 | 3V_REGULATOR.3 39.62,47.62 41.15,49.15 41.28,49.15 42.42,50.29 C4.2 42.54,50.29 43.56,49.28 50.42,49.28 | 50.42,49.28 50.42,49.91 50.29,50.04 D1.C 50.42,49.28
N$21
  Top 1.27: Q1.4 55.88,35.56 60.96,38.1 J20.1
N$30
  Top 0.254: R18.2 69.47,67.18 68.58,66.29 D5.A
N$31
  Top 0.254: R19.2 64.39,68.58 64.39,67.06 63.63,66.29 D6.A
PA02  (via drill 0.33)
  Top 0.254: v23.62,30.48 22.48,30.48 U$1.3
  Bottom 0.254: v23.62,30.48 16.38,30.48 2.54,44.32 J8.2
PA03
  Top 0.254: J8.1 16.51,39.37 24.38,31.5 24.38,30.1 24,29.72 22.48,29.72 U$1.4
PA04
  Top 0.254: U$1.5 22.35,28.83 17.4,28.83 16.51,29.72 16.51,31.24 15.75,32 4.7,32 2.54,34.16 J9.2
PA05
  Top 0.254: J9.1 3.68,28.07 22.35,28.07 U$1.6
PA06
  Top 0.254: U$1.7 22.35,27.18 5.59,27.18 2.54,24.13 J10.2
PA07
  Top 0.254: J10.1 9.78,26.29 22.35,26.29 U$1.8
PA08
  Top 0.254: J11.1 16.51,5.71 22.61,11.81 22.61,19.56 23.37,20.32 24.89,20.32 25.4,20.83 25.4,24.89 U$1.11
PA09
  Top 0.254: U$1.12 26.29,24.89 26.29,19.94 26.54,19.68 26.54,14.99 21.59,10.03 21.59,2.54 J11.2
PA10
  Top 0.254: J12.1 27.05,2.92 27.05,24.89 U$1.13
PA11
  Top 0.254: U$1.14 27.94,24.89 27.94,6.22 31.62,2.54 J12.2
PA14
  Top 0.254: J5.1 28.7,10.67 28.7,24.89 U$1.15
PA15
  Top 0.254: U$1.16 29.59,24.89 29.59,21.97 41.78,9.78 41.78,2.54 J5.2
PA16
  Top 0.254: J6.1 46.99,5.33 38.48,13.84 38.48,22.1 34.29,26.29 30.99,26.29 U$1.17
PA17  (via drill 0.33)
  Top 0.254: v32.26,27.18 30.99,27.18 U$1.18 | v39.24,18.92 39.24,15.24 51.94,2.54 J6.2 | v62.48,58.29 62.48,68.58 R19.1
  Bottom 0.254: v32.26,27.18 32.26,24.51 37.85,18.92 v39.24,18.92 | v62.48,58.29 71.25,49.53 71.25,16.51 58.67,3.94 53.47,3.94 52.07,2.54 J6.2
PA18
  Top 0.254: J7.1 57.15,10.92 49.53,18.54 48.01,18.54 47.12,19.43 42.04,19.43 33.53,27.94 30.99,27.94 U$1.19
PA19  (via drill 0.33)
  Top 0.254: 48.77,16.64 48.77,8.26 55.88,1.14 60.71,1.14 62.1,2.54 J7.2 | 48.77,16.64 R3.2 | v37.47,25.15 33.91,28.7 30.99,28.7 U$1.20 | v40.39,18.92 40.39,18.41 42.16,16.64 48.77,16.64
  Bottom 0.254: v37.47,25.15 37.47,21.84 v40.39,18.92
PA22
  Top 0.254: J16.1 46.99,59.05 37.97,50.04 37.97,43.82 35.31,41.15 35.31,33.27 31.75,29.72 30.99,29.72 U$1.21
PA23  (via drill 0.33)
  Top 0.254: v36.45,49.28 36.45,43.56 34.8,41.91 34.8,33.53 31.75,30.48 30.99,30.48 U$1.22
  Bottom 0.254: v36.45,49.28 36.45,61.85 41.91,67.31 J16.2
RESET
  Top 0.254: JP5.10 38.35,29.59 38.35,24.64 R1.1 | X2.10 25.4,46.48 28.57,43.31 28.57,33.53 U$1.26 28.7,33.4 28.7,32.77 29.59,31.88 29.59,26.29 33.27,22.61 36.07,22.61 S1.1
  Bottom 0.254: JP5.10 36.19,29.21 36.19,22.61 S1.1
SPOT_LIGHT
  Top 0.254: R3.1 48.77,22.48 48.64,22.61 Q1.1
SWCLK  (via drill 0.33)
  Top 0.254: v23.88,34.92 24,34.92 24.64,34.29 24.64,33.53 U$1.31 | v22.61,44.58 21.59,45.59 X2.4
  Bottom 0.254: v23.88,34.92 23.88,43.31 23.81,43.37 | v22.61,44.58 23.81,43.37 | JP5.4 39.5,36.32 39.5,44.83 38.73,45.59 35.69,45.59 | 35.69,45.59 27.43,45.59 25.27,43.43 23.88,43.43 23.81,43.37 | J14.1 36.83,62.99 35.69,61.85 35.69,45.59
SWDIO  (via drill 0.33)
  Top 0.254: U$1.32 23.75,33.53 23.75,33.91 19.56,38.1 19.56,45.72 20.32,46.48 X2.2 20.32,53.09 33.21,65.98 | v37.21,44.2 37.21,50.04 46.48,59.31 46.48,61.34 41.91,65.91 33.27,65.91 33.21,65.98 | 33.21,65.98 31.88,67.31 J14.2
  Bottom 0.254: JP5.2 37.47,43.94 v37.21,44.2
V_USB  (via drill 0.33, 0.35)
  Top 0.254: 12.06,66.17 12.06,65.79 J13.1 | v44.96,64.01 44.96,66.42 42.67,68.71 31.24,68.71 29.59,67.06 22.48,67.06 v22.22,65.91 13.84,64.64 13.79,64.7 12.73,64.7 12.11,65.32 12.11,65.63 J13.1 | D4.A 55.12,42.42 55.12,40.01 D2.A 55.12,39.88 70.74,39.88 71.25,39.37 71.25,36.83 69.85,35.43 J18.2 | 12.06,65.28 12.06,65.66 J13.1
  Bottom 0.254: v44.96,64.01 44.96,50.04 54.99,40.01 D2.A | J2.1 2.54,10.79 1.14,12.19 1.14,52.58 6.35,62.23 21.59,65.62 21.59,65.91 v22.22,65.91

### Text on the board
tPlace: Test Layout for SAMD21E / 32 QFP Package / Serial Wire Debug (SWD) / SWDIO is on PA31 / SWCLK is on PA30 / Thomas Hudson / 02/21/19 | 3.3V | PA23 | PA22 | PA17 | PA25/D+ | PA24/D- | PA31/SWDI | 12V | PA30/SWCLK | GND | PA02 | 3.3V Reg | 12V | PA03 | LIGHT | PA04 | VUSB | PA05 | GND | PA06 | 3.3V | N-CH on PA19 | PA07 | RESET | GND | 12V | VUSB | PA08 | PA09 | PA10 | PA11 | PA14 | PA15 | PA16 | PA17 | PA18 | PA19 | 3V | GND